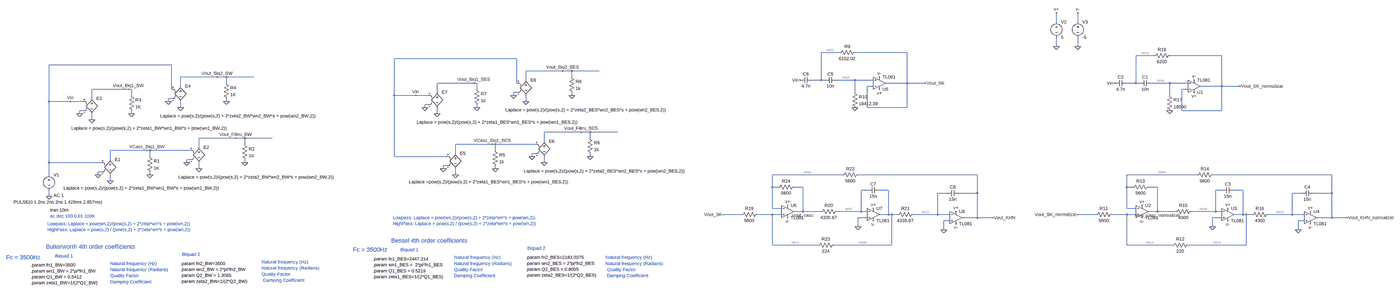
[diagram p0: schematic Proiect_Varo_Gabriela_Bianca.asc, whole sheet]
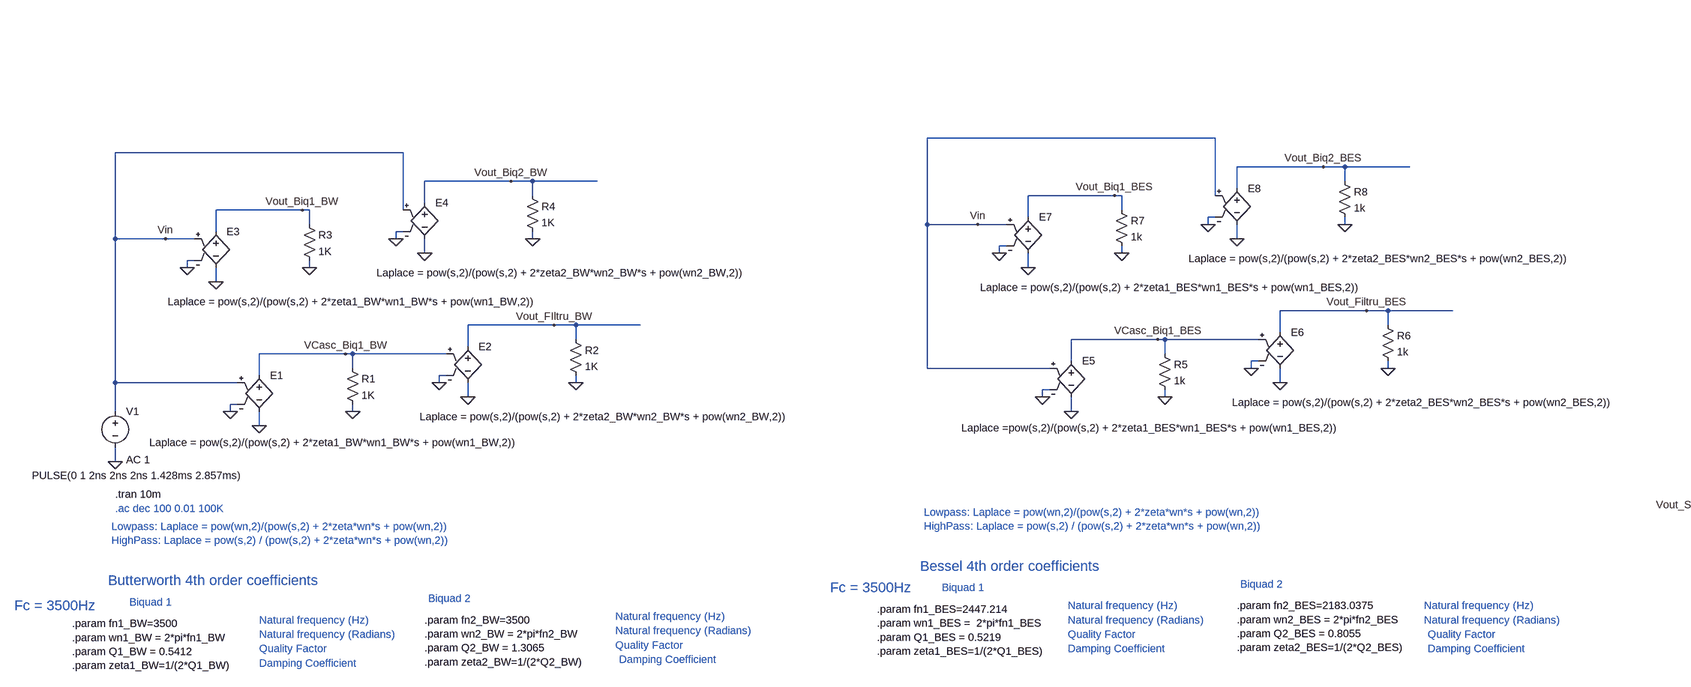
[diagram p1: schematic Proiect_Varo_Gabriela_Bianca.asc, part, row 1 of 1, column 1 of 2]
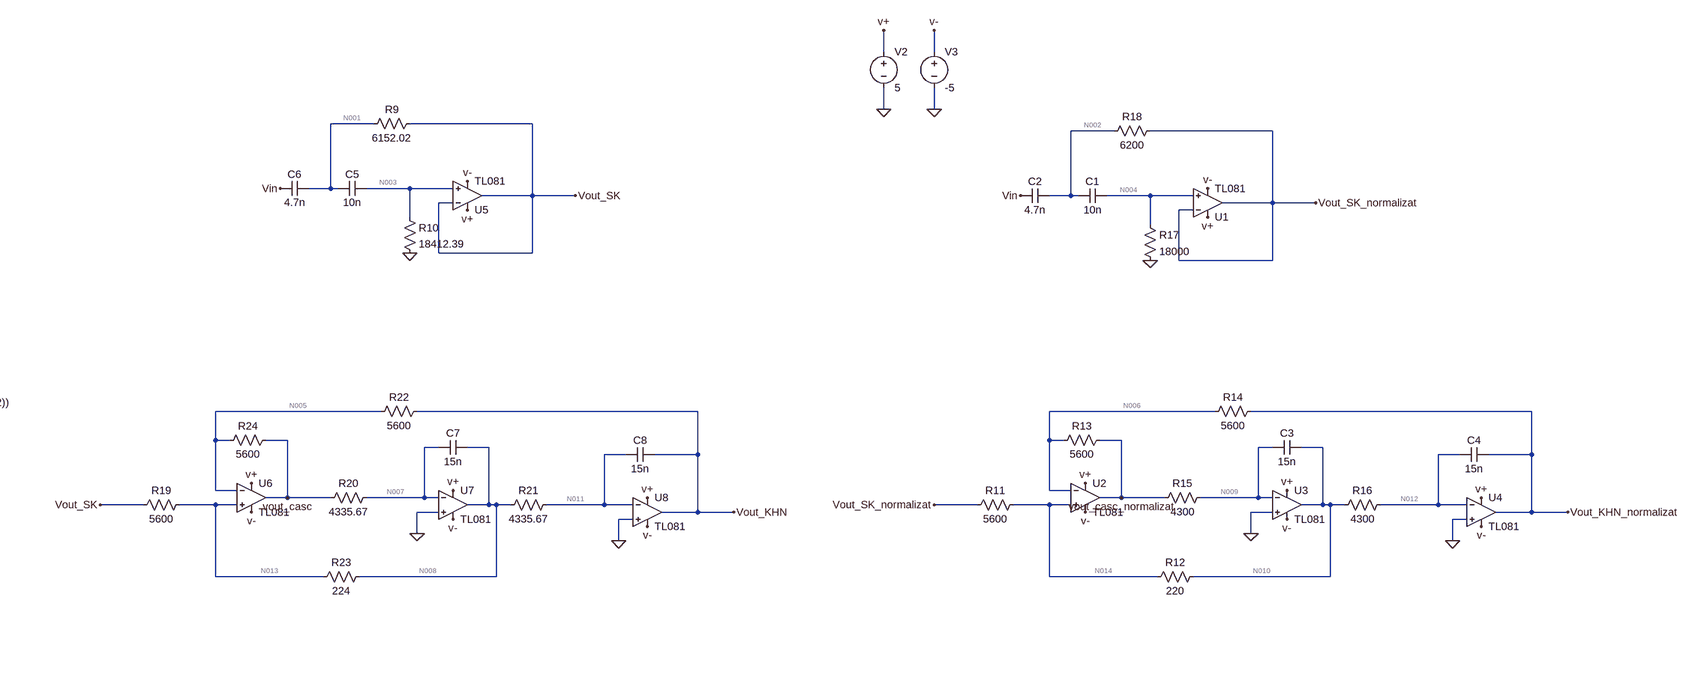
[diagram p2: schematic Proiect_Varo_Gabriela_Bianca.asc, part, row 1 of 1, column 2 of 2]
* Proiect_Varo_Gabriela_Bianca.asc
V1 Vin 0 PULSE(0 1 2ns 2ns 2ns 1.428ms 2.857ms) AC 1
E1 VCasc_Biq1_BW 0 Vin 0 Laplace = pow(s,2)/(pow(s,2) + 2*zeta1_BW*wn1_BW*s + pow(wn1_BW,2))
E2 Vout_FIltru_BW 0 VCasc_Biq1_BW 0 Laplace = pow(s,2)/(pow(s,2) + 2*zeta2_BW*wn2_BW*s + pow(wn2_BW,2))
R1 VCasc_Biq1_BW 0 1K
R2 Vout_FIltru_BW 0 1K
E3 Vout_Biq1_BW 0 Vin 0 Laplace = pow(s,2)/(pow(s,2) + 2*zeta1_BW*wn1_BW*s + pow(wn1_BW,2))
E4 Vout_Biq2_BW 0 Vin 0 Laplace = pow(s,2)/(pow(s,2) + 2*zeta2_BW*wn2_BW*s + pow(wn2_BW,2))
R3 Vout_Biq1_BW 0 1K
R4 Vout_Biq2_BW 0 1K
E5 VCasc_Biq1_BES 0 Vin 0 Laplace =pow(s,2)/(pow(s,2) + 2*zeta1_BES*wn1_BES*s + pow(wn1_BES,2))
E6 Vout_Filtru_BES 0 VCasc_Biq1_BES 0 Laplace = pow(s,2)/(pow(s,2) + 2*zeta2_BES*wn2_BES*s + pow(wn2_BES,2))
R5 VCasc_Biq1_BES 0 1k
R6 Vout_Filtru_BES 0 1k
E7 Vout_Biq1_BES 0 Vin 0 Laplace = pow(s,2)/(pow(s,2) + 2*zeta1_BES*wn1_BES*s + pow(wn1_BES,2))
E8 Vout_Biq2_BES 0 Vin 0 Laplace = pow(s,2)/(pow(s,2) + 2*zeta2_BES*wn2_BES*s + pow(wn2_BES,2))
R7 Vout_Biq1_BES 0 1k
R8 Vout_Biq2_BES 0 1k
R18 Vout_SK_normalizat N002 6200
C1 N004 N002 10n
C2 N002 Vin 4.7n
R17 N004 0 18000
V2 v+ 0 5
V3 v- 0 -5
* U1: TL081 (symbol TL081 not available, pins judged from their places): In+=N004 In-=Vout_SK_normalizat V+=v+ V-=v- OUT=Vout_SK_normalizat
* U2: TL081 (symbol TL081 not available, pins judged from their places): In+=N014 In-=N006 V+=v+ V-=v- OUT=vout_casc_normalizat
* U3: TL081 (symbol TL081 not available, pins judged from their places): In+=0 In-=N009 V+=v+ V-=v- OUT=N010
* U4: TL081 (symbol TL081 not available, pins judged from their places): In+=0 In-=N012 V+=v+ V-=v- OUT=Vout_KHN_normalizat
R11 N014 Vout_SK_normalizat 5600
R15 N009 vout_casc_normalizat 4300
R16 N012 N010 4300
R14 Vout_KHN_normalizat N006 5600
R12 N010 N014 220
R13 vout_casc_normalizat N006 5600
C3 N010 N009 15n
C4 Vout_KHN_normalizat N012 15n
R9 Vout_SK N001 6152.02
C5 N003 N001 10n
C6 N001 Vin 4.7n
R10 N003 0 18412.39
* U5: TL081 (symbol TL081 not available, pins judged from their places): In+=N003 In-=Vout_SK V+=v+ V-=v- OUT=Vout_SK
* U6: TL081 (symbol TL081 not available, pins judged from their places): In+=N013 In-=N005 V+=v+ V-=v- OUT=vout_casc
* U7: TL081 (symbol TL081 not available, pins judged from their places): In+=0 In-=N007 V+=v+ V-=v- OUT=N008
* U8: TL081 (symbol TL081 not available, pins judged from their places): In+=0 In-=N011 V+=v+ V-=v- OUT=Vout_KHN
R19 N013 Vout_SK 5600
R20 N007 vout_casc 4335.67
R21 N011 N008 4335.67
R22 Vout_KHN N005 5600
R23 N008 N013 224
R24 vout_casc N005 5600
C7 N008 N007 15n
C8 Vout_KHN N011 15n
.param fn1_BW=3500
.param wn1_BW = 2*pi*fn1_BW
.param Q1_BW = 0.5412
.param zeta1_BW=1/(2*Q1_BW)
* .ac dec 100 0.01 100K
* Natural frequency (Hz)
* Natural frequency (Radians)
* Damping Coefficient
* Biquad 1
* Lowpass: Laplace = pow(wn,2)/(pow(s,2) + 2*zeta*wn*s + pow(wn,2))
* HighPass: Laplace = pow(s,2) / (pow(s,2) + 2*zeta*wn*s + pow(wn,2))
.param fn2_BW=3500
.param wn2_BW = 2*pi*fn2_BW
.param Q2_BW = 1.3065
.param zeta2_BW=1/(2*Q2_BW)
* Natural frequency (Hz)
* Natural frequency (Radians)
* Damping Coefficient
* Quality Factor
* Quality Factor
* Butterworth 4th order coefficients
* Biquad 2
.param fn1_BES=2447.214
.param wn1_BES =  2*pi*fn1_BES
.param Q1_BES = 0.5219
.param zeta1_BES=1/(2*Q1_BES)
* Natural frequency (Hz)
* Natural frequency (Radians)
* Damping Coefficient
* Biquad 1
* Lowpass: Laplace = pow(wn,2)/(pow(s,2) + 2*zeta*wn*s + pow(wn,2))
* HighPass: Laplace = pow(s,2) / (pow(s,2) + 2*zeta*wn*s + pow(wn,2))
.param fn2_BES=2183.0375
.param wn2_BES = 2*pi*fn2_BES
.param Q2_BES = 0.8055
.param zeta2_BES=1/(2*Q2_BES)
* Natural frequency (Hz)
* Natural frequency (Radians)
* Damping Coefficient
* Quality Factor
* Quality Factor
* Bessel 4th order coefficients
* Biquad 2
* Fc = 3500Hz
* Fc = 3500Hz
.tran 10m
.backanno
.end

* Results of the author's LTspice run, read from the files saved beside the schematic
* Operating Point, zero values left out:
*   V(v+) = 5 V
*   V(n009) = -2.137 mV
*   V(n005) = -4.274 mV
*   V(vout_sk_normalizat) = -2.138 mV
*   V(vout_khn) = -6.411 mV
*   V(n001) = -2.138 mV
*   V(n014) = -2.137 mV
*   V(n007) = -2.137 mV
*   V(n012) = -2.137 mV
*   V(n004) = -810.9 nV
*   V(n013) = -2.137 mV
*   V(n011) = -2.137 mV
*   V(vout_casc_normalizat) = -2.137 mV
*   V(vout_sk) = -2.138 mV
*   V(v-) = -5 V
*   V(vout_casc) = -2.137 mV
*   V(n010) = -2.137 mV
*   V(n002) = -2.138 mV
*   V(n003) = -829.5 nV
*   V(n008) = -2.137 mV
*   V(n006) = -4.274 mV
*   V(vout_khn_normalizat) = -6.411 mV
*   I(R16) = -55.05 pA
*   I(R21) = -55.05 pA
*   I(R12) = 226.6 pA
*   I(R17) = -45.05 pA
*   I(R23) = 230 pA
*   I(R15) = -55.05 pA
*   I(R20) = -55.05 pA
*   I(V3) = 38.89 mA
*   I(R10) = -45.05 pA
*   I(R14) = -381.6 nA
*   I(R22) = -381.6 nA
*   I(R11) = 181.6 pA
*   I(R19) = 185 pA
*   I(R13) = 381.7 nA
*   I(V2) = -38.89 mA
*   I(R24) = 381.7 nA
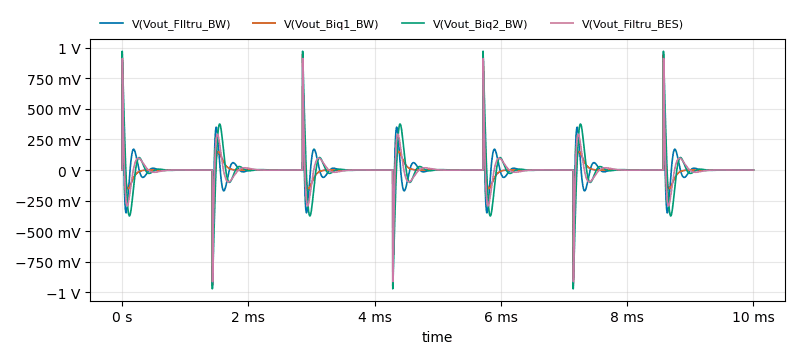
[diagram p3: Transient Analysis of Proiect_Varo_Gabriela_Bianca.asc, plotted from the saved traces]
* Transient Analysis, 1 run:
*   V(Vout_FIltru_BW): min -894.3 mV, max 894.8 mV, average -2.724 µV, rms 100.7 mV, last 124.3 nV
*   V(Vout_Biq1_BW): min -946.9 mV, max 946.5 mV, average -2.413 µV, rms 92.06 mV, last 130.3 µV
*   V(Vout_Biq2_BW): min -971.7 mV, max 971.7 mV, average 449.7 µV, rms 143.4 mV, last 957.4 µV
*   V(Vout_Filtru_BES): min -912.4 mV, max 912.5 mV, average -4.447 µV, rms 101.9 mV, last -3.954 µV